# EAGLE design eGatewayShield (EAGLE 7.2.0)
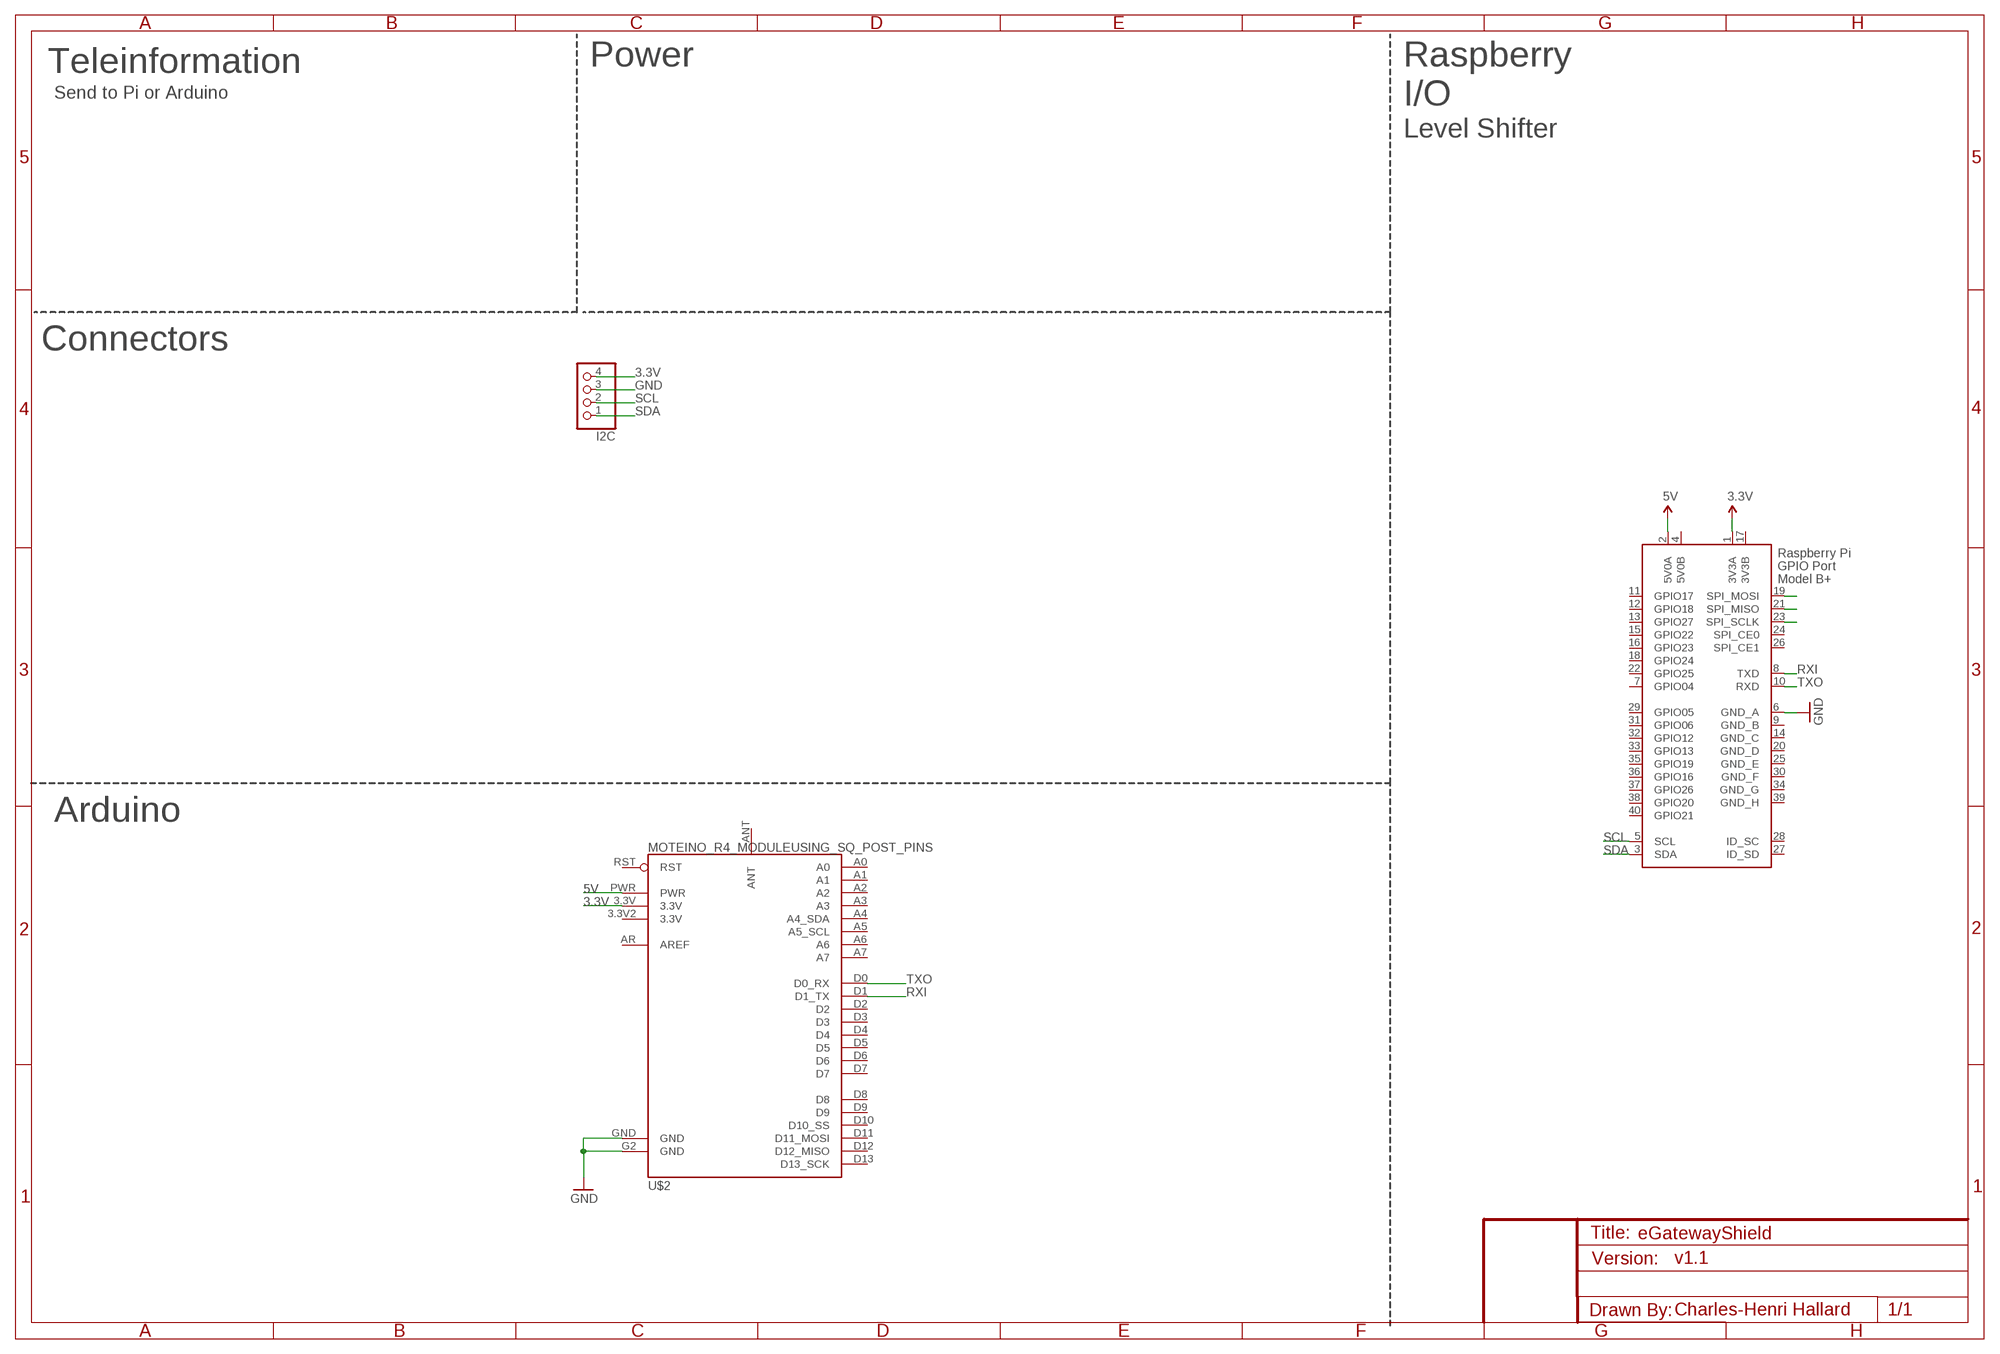
[diagram p0: schematic, sheet 1]

## Parts
I2C  PINHD-1X4  [1X04]
U$2  MOTEINO_R4_MODULEUSING_SQ_POST_PINS  [MOTEINTO_R4_SQ]
X1  RASPI_BOARD_B+#_F  [RASPI_BOARD_B+_FULL]

## Nets
3.3V: I2C.4 U$2.3.3V X1.1(3V3A)
5V: U$2.PWR X1.2(5V0A)
GND [power]: I2C.3 U$2.G2(GND) U$2.GND X1.6(GND_A)
N$3: X1.23(SPI_SCLK)
N$4: X1.21(SPI_MISO)
N$5: X1.19(SPI_MOSI)
RXI: U$2.D1(D1_TX) X1.8(TXD)
SCL: I2C.2 X1.5(SCL)
SDA: I2C.1 X1.3(SDA)
TXO: U$2.D0(D0_RX) X1.10(RXD)
Unconnected: U$2.3.3V2(3.3V) U$2.A0 U$2.A1 U$2.A2 U$2.A3 U$2.A4(A4_SDA) U$2.A5(A5_SCL) U$2.A6 U$2.A7 U$2.ANT U$2.AR(AREF) U$2.D2 U$2.D3 U$2.D4 U$2.D5 U$2.D6 U$2.D7 U$2.D8 U$2.D9 U$2.D10(D10_SS) U$2.D11(D11_MOSI) U$2.D12(D12_MISO) U$2.D13(D13_SCK) U$2.RST X1.7(GPIO04) X1.11(GPIO17) X1.12(GPIO18) X1.13(GPIO27) X1.15(GPIO22) X1.16(GPIO23) X1.18(GPIO24) X1.22(GPIO25) X1.24(SPI_CE0) X1.26(SPI_CE1) X1.27(ID_SD) X1.28(ID_SC) X1.29(GPIO05) X1.31(GPIO06) X1.32(GPIO12) X1.33(GPIO13) X1.35(GPIO19) X1.36(GPIO16) X1.37(GPIO26) X1.38(GPIO20) X1.40(GPIO21)

## Notes on the sheet
- Teleinformation | Power
- Send to Pi or Arduino
- Raspberry
  I/O
- Level Shifter
- Connectors
- Arduino
- v1.1
- Charles-Henri Hallard

## Power pins joined to a net without a drawn wire
3V3B: X1.17(3V3B)
5V0B: X1.4(5V0B)
GND_B: X1.9(GND_B)
GND_C: X1.14(GND_C)
GND_D: X1.20(GND_D)
GND_E: X1.25(GND_E)
GND_F: X1.30(GND_F)
GND_G: X1.34(GND_G)
GND_H: X1.39(GND_H)

## Library data of the parts
I2C = pinhead:PINHD-1X4: PIN HEADER
U$2 = MoteinoR4Mod:MOTEINO_R4_MODULE: Moteino Module as a device. Available in two footprints, one with pads for 0.025" sq pins, and one using wire pins.
X1 = raspberrypi_bastelstube_v13:RASPI_BOARD_B+#: Raspberry Pi GPIO connector with markings for the outer dimensions of the Raspberry Pi board model B+ with different sets of drill holes or mounting pads All pins connected

## Net classes
1 power: width 0.381 mm, clearance 0.254 mm
2 VDD: width 0.203 mm, drill 0.305 mm, clearance 0.152 mm
3 3V3-PI: width 0.203 mm, drill 0.305 mm, clearance 0.152 mm
4 5V-PI: width 0.203 mm, drill 0.305 mm, clearance 0.152 mm
5 VIN: width 0.305 mm, drill 0.305 mm, clearance 0.152 mm
6 5V-EXT: width 0.203 mm, drill 0.305 mm, clearance 0.152 mm
7 3V3-EXT: width 0.203 mm, drill 0.305 mm, clearance 0.152 mm

## Board
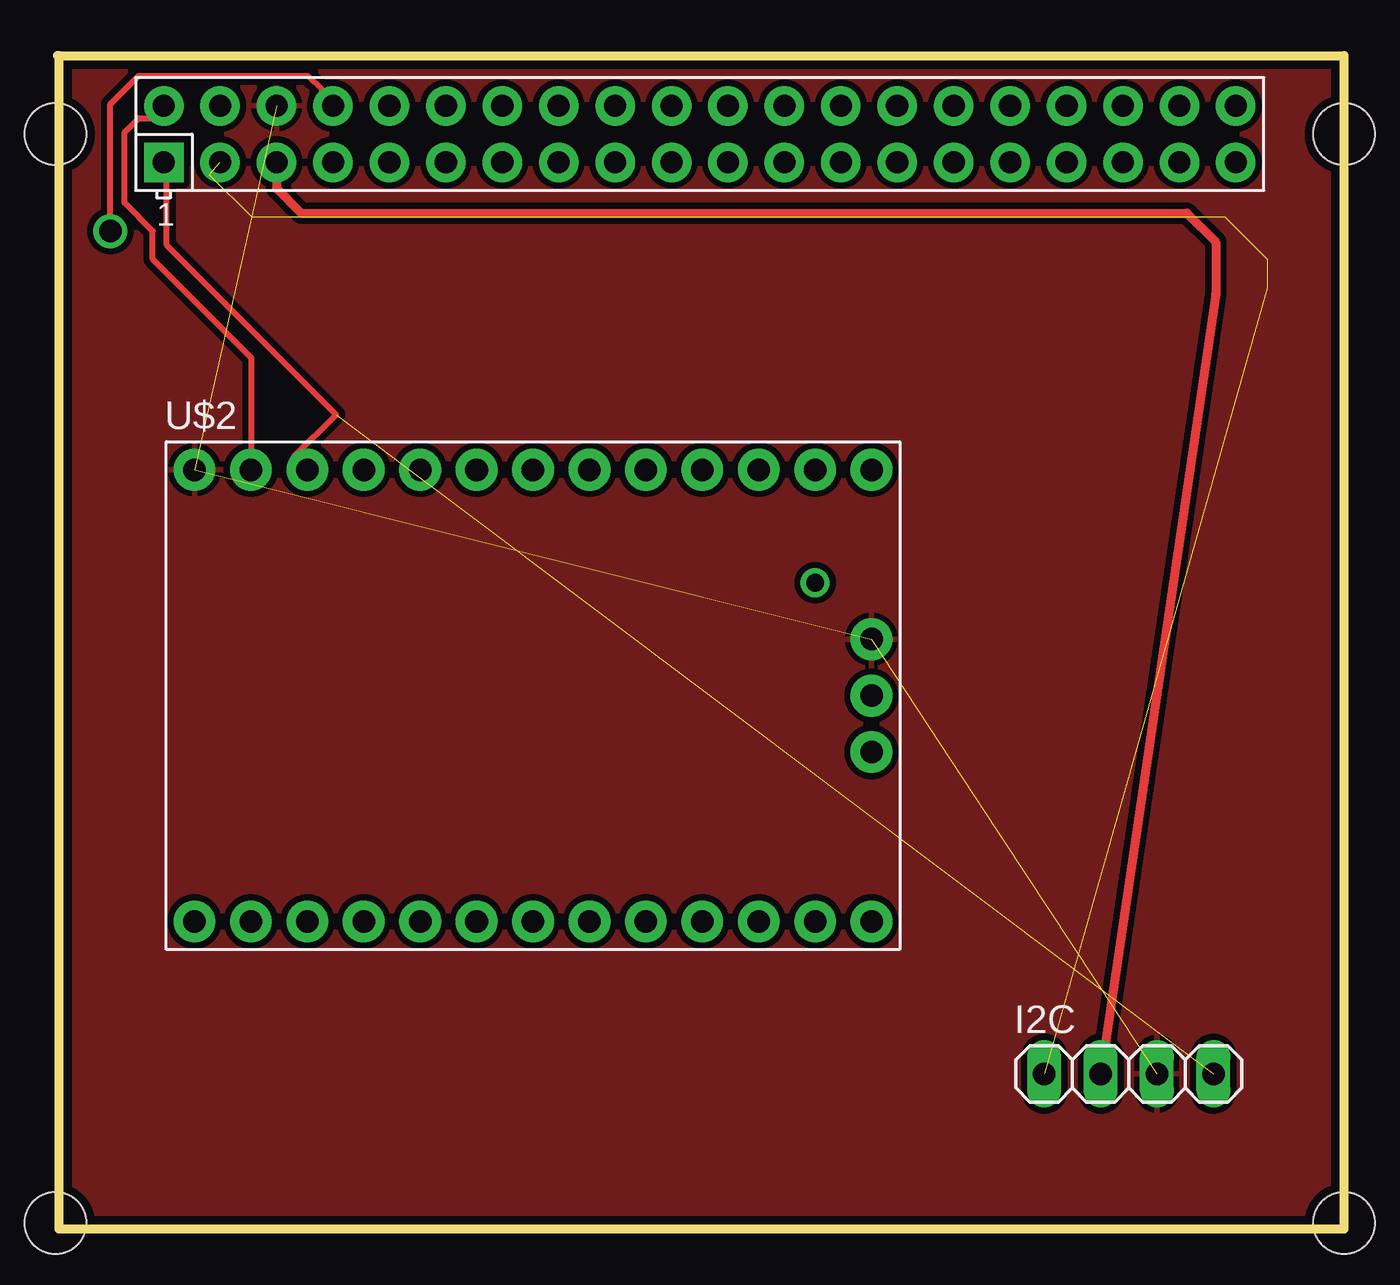
[diagram p1: board, top side]
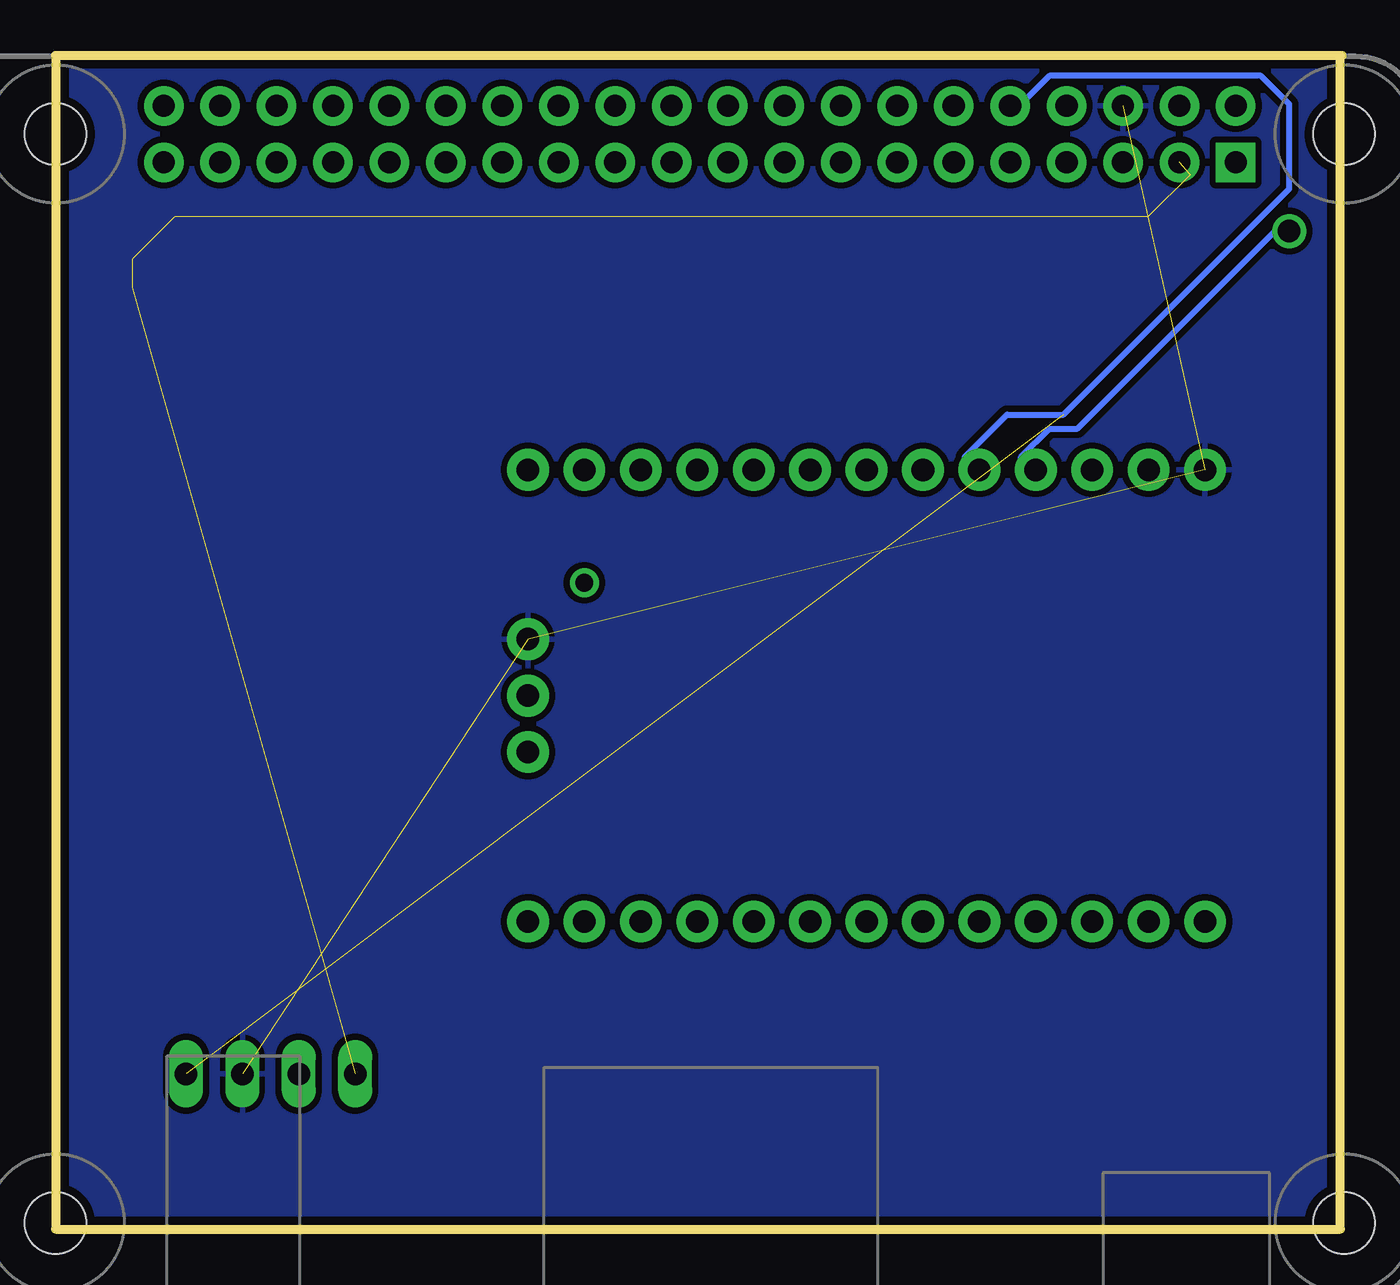
[diagram p2: board, bottom side, seen from below]

Size 57.91 x 52.81 mm. Coordinates in mm from the lower left corner, seen from the top.
Outline: 0,52.81 0.08,52.81
Outline: 0.08,52.81 57.91,52.81 57.91,0 0.08,0 0.08,52.81
Copper layers (1*16): Top 0.035mm / dielectric 1.5mm / Bottom 0.035mm
Design rules "SeeedStudio_DRU_no_angle_20130527 *": minimum track width 11mil, minimum drill 40mil, track to track 11mil, track to pad 11mil, pad to pad 11mil, via to via 11mil, smd to smd 11mil, copper to edge 15mil, drill to drill 11mil, minimum pad ring 10mil, minimum via ring 6mil, stop-mask expansion 2mil, vias tented up to drill 25mil, thermal gap 10mil

### Footprints (pad centres in the part's own frame; a part is rotated, then mirrored left to right if it is on the bottom)
1X04 = drill 1.016 long: 1 -3.81,0; 2 -1.27,0; 3 1.27,0; 4 3.81,0
MOTEINTO_R4_SQ = drill 1.016 pad 1.88: 3.3V -10.16,10.16; 3.3V2 15.24,0; A0 15.24,10.16; A1 12.7,10.16; A2 10.16,10.16; A3 7.62,10.16; A4 5.08,10.16; A5 2.54,10.16; A6 0,10.16; A7 -2.54,10.16; AR 15.24,-2.54; D0 -5.08,10.16; D1 -7.62,10.16; D2 -12.7,-10.16; D3 -10.16,-10.16; D4 -7.62,-10.16; D5 -5.08,-10.16; D6 -2.54,-10.16; D7 0,-10.16; D8 2.54,-10.16; D9 5.08,-10.16; D10 7.62,-10.16; D11 10.16,-10.16; D12 12.7,-10.16; D13 15.24,-10.16; G2 15.24,2.54; GND -15.24,10.16; PWR -12.7,10.16; RST -15.24,-10.16 | drill 0.8: ANT 12.7,5.08
RASPI_BOARD_B+_FULL = drill 1 pad 1.778 square: 1 8.37,51.23 | drill 1 pad 1.778: 2 8.37,53.77; 3 10.91,51.23; 4 10.91,53.77; 5 13.45,51.23; 6 13.45,53.77; 7 15.99,51.23; 8 15.99,53.77; 9 18.53,51.23; 10 18.53,53.77; 11 21.07,51.23; 12 21.07,53.77; 13 23.61,51.23; 14 23.61,53.77; 15 26.15,51.23; 16 26.15,53.77; 17 28.69,51.23; 18 28.69,53.77; 19 31.23,51.23; 20 31.23,53.77; 21 33.77,51.23; 22 33.77,53.77; 23 36.31,51.23; 24 36.31,53.77; 25 38.85,51.23; 26 38.85,53.77; 27 41.39,51.23; 28 41.39,53.77; 29 43.93,51.23; 30 43.93,53.77; 31 46.47,51.23; 32 46.47,53.77; 33 49.01,51.23; 34 49.01,53.77; 35 51.55,51.23; 36 51.55,53.77; 37 54.09,51.23; 38 54.09,53.77; 39 56.63,51.23; 40 56.63,53.77 | hole 2.75: 3.5,3.5; 3.5,52.5; 61.5,3.5; 61.5,52.5

### Placement (x,y rotation side)
I2C  48.23,6.98 0 top
U$2  21.41,24 0 top
X1  -3.58,-3.23 0 top

### Tracks (layer width: path | path; a pad name or v marks a point on that pad's centre or on a via)
3.3V  (1 unrouted)
  Top 0.279: U$2.3.3V 10.64,34.75 12.55,36.65 4.93,44.27 4.93,47.45 X1.1
5V
  Top 0.279: X1.2 4.29,49.99 3.66,49.99 3.02,49.35 3.02,46.18 4.29,44.91 4.29,43.64 8.74,39.19 8.74,34.75 U$2.PWR
GND  (3 unrouted)
  pour Bottom (isolate 0.203, rank 6): -2.67,54.03 64.97,54.15 64.77,-2.69 -2.87,-2.82
  pour Top (isolate 0.203, rank 6): -2.57,54.1 65,54.18 64.69,-2.72 -2.87,-2.79
RXI  (via drill 1.02)
  Top 0.279: v2.39,44.91 2.39,50.62 3.66,51.89 11.28,51.89 11.91,51.26 11.91,50.62 X1.8
  Bottom 0.279: v2.39,44.91 3.02,44.91 11.91,36.02 13.18,36.02 14.45,34.75 14.45,34.11 13.82,34.11 U$2.D1
SCL
  Top 0.406: X1.5 9.87,46.82 10.97,45.72 50.85,45.72 52.15,44.42 52.15,42.09 I2C.2
SDA  (6 unrouted)
TXO
  Bottom 0.279: X1.10 14.45,50.62 13.18,51.89 3.66,51.89 2.39,50.62 2.39,46.81 12.55,36.65 15.09,36.65 16.99,34.75 16.99,34.11 16.36,34.11 U$2.D0